# EAGLE design YOTSUBA_MC_ver.2.0 (EAGLE 9.6.2)
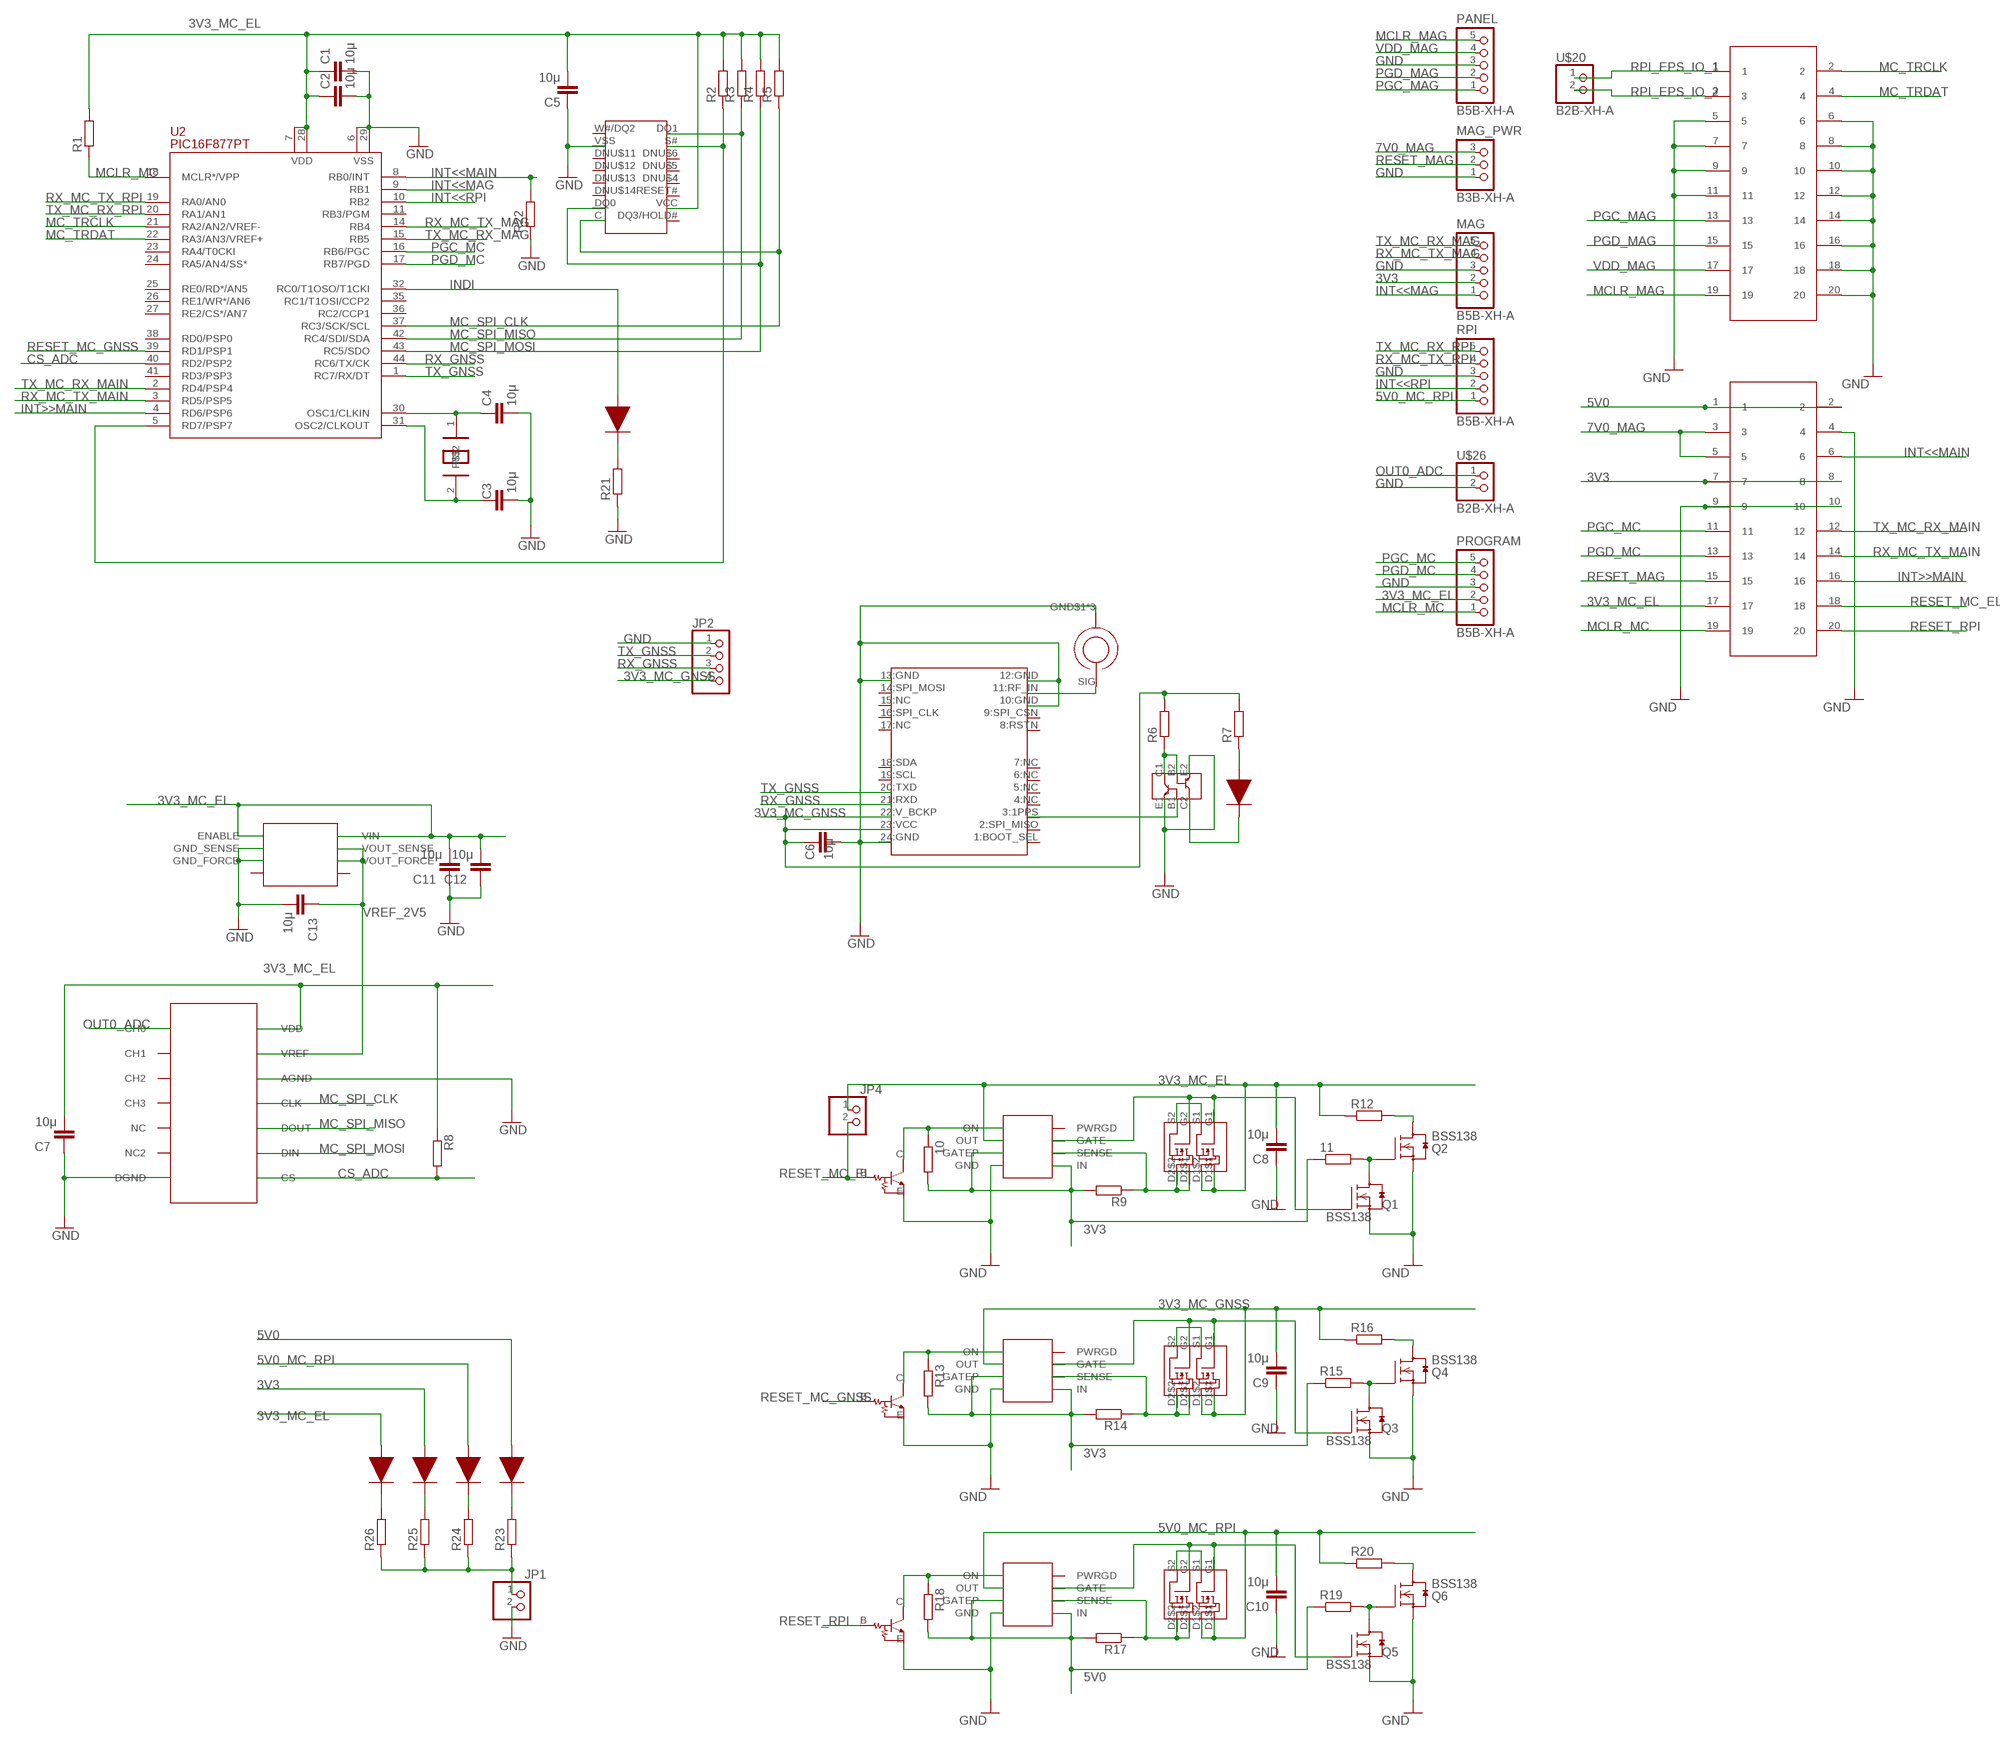
[diagram p0: schematic, sheet 1]

## Parts
10  R-EU_M2012  [M2012]
11  R-EU_M2012  [M2012]
C1  10μ  C-EUC2012  [C2012]
C2  10μ  C-EUC2012  [C2012]
C3  10μ  C-EUC2012  [C2012]
C4  10μ  C-EUC2012  [C2012]
C5  10μ  C-EUC2012  [C2012]
C6  10μ  C-EUC2012  [C2012]
C7  10μ  C-EUC2012  [C2012]
C8  10μ  C-EUC2012  [C2012]
C9  10μ  C-EUC2012  [C2012]
C10  10μ  C-EUC2012  [C2012]
C11  10μ  C-EUC2012  [C2012]
C12  10μ  C-EUC2012  [C2012]
C13  10μ  C-EUC2012  [C2012]
CLK1  HC49/4H  [HC49/4H]
JP1  PINHD-1X2  [1X02]
JP2  PINHD-1X4  [1X04]
JP4  PINHD-1X2  [1X02]
MAG  B5B-XH-A  [B5B-XH-A]
MAG_PWR  B3B-XH-A  [B3B-XH-A]
PANEL  B5B-XH-A  [B5B-XH-A]
PROGRAM  B5B-XH-A  [B5B-XH-A]
Q1  BSS138  [SOT23]
Q2  BSS138  [SOT23]
Q3  BSS138  [SOT23]
Q4  BSS138  [SOT23]
Q5  BSS138  [SOT23]
Q6  BSS138  [SOT23]
R1  R-EU_M2012  [M2012]
R2  R-EU_M2012  [M2012]
R3  R-EU_M2012  [M2012]
R4  R-EU_M2012  [M2012]
R5  R-EU_M2012  [M2012]
R6  R-EU_M2012  [M2012]
R7  R-EU_M2012  [M2012]
R8  R-EU_M2012  [M2012]
R9  R-EU_M2012  [M2012]
R12  R-EU_M2012  [M2012]
R13  R-EU_M2012  [M2012]
R14  R-EU_M2012  [M2012]
R15  R-EU_M2012  [M2012]
R16  R-EU_M2012  [M2012]
R17  R-EU_M2012  [M2012]
R18  R-EU_M2012  [M2012]
R19  R-EU_M2012  [M2012]
R20  R-EU_M2012  [M2012]
R21  R-EU_M2012  [M2012]
R22  R-EU_M2012  [M2012]
R23  R-EU_M2012  [M2012]
R24  R-EU_M2012  [M2012]
R25  R-EU_M2012  [M2012]
R26  R-EU_M2012  [M2012]
RPI  B5B-XH-A  [B5B-XH-A]
U2  PIC16F877PT  [TQFP44]
U$1  MT25QL512_16SOP2  [SOIC127P1032X265-16N]
U$2  ORION_B16  [ORION_B16]
U$3  HN1C01FU  [SOT65P210X100-6N]
U$4  LED_1608  [LED_1608]
U$5  U.FL-R  [U.FL-R]
U$6  MCP3204_S  [MCP3204_S]
U$7  DMG6898LSD  [SOIC127P600X150-8N]
U$8  LTC4361  [SOP65P280X100-8N]
U$9  DTC144EKA  [SOT-346]
U$10  DMG6898LSD  [SOIC127P600X150-8N]
U$11  LTC4361  [SOP65P280X100-8N]
U$12  DTC144EKA  [SOT-346]
U$13  DMG6898LSD  [SOIC127P600X150-8N]
U$14  LTC4361  [SOP65P280X100-8N]
U$15  DTC144EKA  [SOT-346]
U$17  M50-3001045  [M50-3001045]
U$18  LED_1608  [LED_1608]
U$19  ADR35XX  [SOP65P490X110-8N]
U$20  B2B-XH-A  [B2B-XH-A]
U$21  LED_1608  [LED_1608]
U$22  M50-3001045  [M50-3001045]
U$23  LED_1608  [LED_1608]
U$24  LED_1608  [LED_1608]
U$25  LED_1608  [LED_1608]
U$26  B2B-XH-A  [B2B-XH-A]

## Nets
3V3 [POWER]: 10.2 11.1 MAG.2 R9.2 R13.2 R14.2 R15.1 U$8.GATEP U$8.IN U$11.GATEP U$11.IN U$17.7 U$17.8 U$24.A
3V3_MC_EL [POWER]: C1.1 C2.1 C5.2 C7.2 C8.2 C11.2 C12.2 JP4.1 PROGRAM.2 R1.2 R2.2 R3.2 R4.2 R5.2 R8.1 R12.1 U2.7(VDD) U2.28(VDD) U$1.VCC U$6.VDD U$7.D1$1 U$7.D1$2 U$8.OUT U$17.17 U$19.ENABLE U$19.VIN U$25.A
3V3_MC_GNSS [POWER]: C6.1 C9.2 JP2.4 R6.2 R7.2 R16.1 U$2.22:V_BCKP U$2.23:VCC U$10.D1$1 U$10.D1$2 U$11.OUT
5V0 [POWER]: R17.2 R18.2 R19.1 U$14.GATEP U$14.IN U$17.1 U$17.2 U$21.A
5V0_MC_RPI [POWER]: C10.2 R20.1 RPI.1 U$13.D1$1 U$13.D1$2 U$14.OUT U$23.A
7V0_MAG [POWER]: MAG_PWR.3 U$17.3 U$17.5
CS_ADC: R8.2 U2.40(RD2/PSP2) U$6.CS
GND [gnd]: C1.2 C2.2 C3.2 C4.2 C5.1 C6.2 C7.1 C8.1 C9.1 C10.1 C11.1 C12.1 C13.2 JP1.2 JP2.1 MAG.3 MAG_PWR.1 PANEL.3 PROGRAM.3 Q1.2(S) Q2.2(S) Q3.2(S) Q4.2(S) Q5.2(S) Q6.2(S) R21.1 R22.1 RPI.3 U2.6(VSS) U2.29(VSS) U$1.VSS U$2.10:GND U$2.12:GND U$2.13:GND U$2.24:GND U$3.E1 U$3.E2 U$5.GND$1(GND) U$5.GND$2(GND) U$5.GND$3(GND) U$6.AGND U$6.DGND U$8.GND U$9.E U$11.GND U$12.E U$14.GND U$15.E U$17.4 U$17.9 U$17.10 U$19.GND_FORCE U$19.GND_SENSE U$22.5 U$22.6 U$22.7 U$22.8 U$22.9 U$22.10 U$22.11 U$22.12 U$22.14 U$22.16 U$22.18 U$22.20 U$26.2
INDI: U2.32(RC0/T1OSO/T1CKI) U$18.A
INT<<MAG: MAG.1 U2.9(RB1)
INT<<MAIN: R22.2 U2.8(RB0/INT) U$17.6
INT<<RPI: RPI.2 U2.10(RB2)
INT>>MAIN: U2.4(RD6/PSP6) U$17.16
MC_SPI_CLK: R5.1 U2.37(RC3/SCK/SCL) U$1.C U$6.CLK
MC_SPI_MISO: R3.1 U2.42(RC4/SDI/SDA) U$1.DQ1 U$6.DOUT
MC_SPI_MOSI: R4.1 U2.43(RC5/SDO) U$1.DQ0 U$6.DIN
MC_TRCLK: U2.21(RA2/AN2/VREF-) U$22.2
MC_TRDAT: U2.22(RA3/AN3/VREF+) U$22.4
MCLR_MAG: PANEL.5 U$22.19
MCLR_MC: PROGRAM.1 R1.1 U2.18(MCLR*/VPP) U$17.19
N$2: R23.2 U$21.C
N$3: C3.1 CLK1.2 U2.31(OSC2/CLKOUT)
N$4: R24.2 U$23.C
N$5: C4.1 CLK1.1 U2.30(OSC1/CLKIN)
N$6: R25.2 U$24.C
N$7: R26.2 U$25.C
N$8: R2.1 U2.5(RD7/PSP7) U$1.S#
N$9: JP1.1 R23.1 R24.1 R25.1 R26.1
N$10: R7.1 U$4.A
N$11: U$3.C2 U$4.C
N$12: U$2.3:1PPS U$3.B1
N$13: R6.1 U$3.B2 U$3.C1
N$15: R21.2 U$18.C
N$17: 10.1 U$8.ON U$9.C
N$18 [ant]: U$2.11:RF_IN U$5.SIG
N$19: U$7.S1 U$7.S2
N$20: R9.1 U$7.D2$1 U$7.D2$2 U$8.SENSE
N$22: Q1.1(G) U$7.G1 U$7.G2 U$8.GATE
N$24: 11.2 Q1.3(D) Q2.1(G)
N$25: R13.1 U$11.ON U$12.C
N$26: Q2.3(D) R12.2
N$28: U$10.S1 U$10.S2
N$29: R14.1 U$10.D2$1 U$10.D2$2 U$11.SENSE
N$30: Q3.1(G) U$10.G1 U$10.G2 U$11.GATE
N$33: Q3.3(D) Q4.1(G) R15.2
N$34: Q4.3(D) R16.2
N$35: R18.1 U$14.ON U$15.C
N$36: U$13.S1 U$13.S2
N$37: R17.1 U$13.D2$1 U$13.D2$2 U$14.SENSE
N$38: Q5.1(G) U$13.G1 U$13.G2 U$14.GATE
N$41: Q5.3(D) Q6.1(G) R19.2
N$42: Q6.3(D) R20.2
OUT0_ADC: U$6.CH0 U$26.1
PGC_MAG: PANEL.1 U$22.13
PGC_MC: PROGRAM.5 U2.16(RB6/PGC) U$17.11
PGD_MAG: PANEL.2 U$22.15
PGD_MC: PROGRAM.4 U2.17(RB7/PGD) U$17.13
RESET_MAG: MAG_PWR.2 U$17.15
RESET_MC_EL: JP4.2 U$9.B U$17.18
RESET_MC_GNSS: U2.39(RD1/PSP1) U$12.B
RESET_RPI: U$15.B U$17.20
RPI_EPS_IO_1: U$20.1 U$22.1
RPI_EPS_IO_2: U$20.2 U$22.3
RX_GNSS: JP2.3 U2.44(RC6/TX/CK) U$2.21:RXD
RX_MC_TX_MAG: MAG.4 U2.14(RB4)
RX_MC_TX_MAIN: U2.3(RD5/PSP5) U$17.14
RX_MC_TX_RPI: RPI.4 U2.19(RA0/AN0)
TX_GNSS: JP2.2 U2.1(RC7/RX/DT) U$2.20:TXD
TX_MC_RX_MAG: MAG.5 U2.15(RB5)
TX_MC_RX_MAIN: U2.2(RD4/PSP4) U$17.12
TX_MC_RX_RPI: RPI.5 U2.20(RA1/AN1)
VDD_MAG: PANEL.4 U$22.17
VREF_2V5: C13.1 U$6.VREF U$19.VOUT_FORCE U$19.VOUT_SENSE
Unconnected: U2.11(RB3/PGM) U2.23(RA4/T0CKI) U2.24(RA5/AN4/SS*) U2.25(RE0/RD*/AN5) U2.26(RE1/WR*/AN6) U2.27(RE2/CS*/AN7) U2.35(RC1/T1OSI/CCP2) U2.36(RC2/CCP1) U2.38(RD0/PSP0) U2.41(RD3/PSP3) U$1.DNU$4 U$1.DNU$5 U$1.DNU$6 U$1.DNU$11 U$1.DNU$12 U$1.DNU$13 U$1.DNU$14 U$1.DQ3/HOLD# U$1.RESET# U$1.W#/DQ2 U$2.1:BOOT_SEL U$2.2:SPI_MISO U$2.4:NC U$2.5:NC U$2.6:NC U$2.7:NC U$2.8:RSTN U$2.9:SPI_CSN U$2.14:SPI_MOSI U$2.15:NC U$2.16:SPI_CLK U$2.17:NC U$2.18:SDA U$2.19:SCL U$6.CH1 U$6.CH2 U$6.CH3 U$6.NC1(NC) U$6.NC2 U$8.PWRGD U$11.PWRGD U$14.PWRGD U$19.NIC@1(NIC) U$19.NIC@2(NIC)

## Library data of the parts
10 11 R1-R9 R12-R26 = rcl:R-EU_: RESISTOR, European symbol; SPICEPREFIX: R
C1-C13 = rcl:C-EU: CAPACITOR, European symbol; SPICEPREFIX: C
CLK1 = aoba01:HC49/4H
JP1 JP4 = pinhead:PINHD-1X2: PIN HEADER
JP2 = pinhead:PINHD-1X4: PIN HEADER
MAG PANEL PROGRAM RPI = MITSUBA_Connectors-v4.0:B5B-XH-A
MAG_PWR = MITSUBA_Connectors-v4.0:B3B-XH-A
Q1-Q6 = m-pad-2.1:BSS138: Fairchild Semiconductors BSS138 N-Channel Logic Level Enhancement Mode Field Effect Transistor General Description: These N-Channel enhancement mode field effect transistors are produced using Fairchild's proprietary, high cell density, DMOS technology. These products have been designed to minimize on-state resistance while provide rugged, reliable, and fast switching performance.These products are particularly suited for low voltage, low current applications such as small servo motor control, power MOSFET gate drivers, and other switching applications. Features: 0.22 A, 50 V. RDS(ON) = 3.5Ohm @ VGS = 10 V RDS(ON) = 6.0Ohm @ VGS = 4.5 V High density cell design for extremely low RDS(ON) Rugged and Reliable Compact industry standard SOT-23 surface mount package Please send any comments to: messi@users.sourceforge.net
U2 = aoba01:PIC16F877: FLASH MICROCONTROLLER
U$1 = MT25QL512_8:MT25QL512_16SOP2
U$2 = Orion_B16:ORION_B16
U$3 = HN1C01FU:HN1C01FU
U$4 U$18 U$21 U$23-U$25 = LED_1608:LED_1608
U$5 = U.FL-R:U.FL-R
U$6 = mcp3204_S:MCP3204_S
U$7 U$10 U$13 = DMG6898LSD:DMG6898LSD
U$8 U$11 U$14 = ltc4361:LTC4361
U$9 U$12 U$15 = DTC144EKA:DTC144EKA
U$17 U$22 = MITSUBA_Connectors-v4.0:M50-3001045: 20pins 1.27mm pitch 2line pinsocket
U$19 = adr35xx:ADR35XX
U$20 U$26 = MITSUBA_Connectors-v4.0:B2B-XH-A

## Net classes
0 default: clearance 0.178 mm
1 ant: clearance 0.559 mm
2 gnd: clearance 0.508 mm
3 POWER: width 0.305 mm, clearance 0.254 mm

## Board
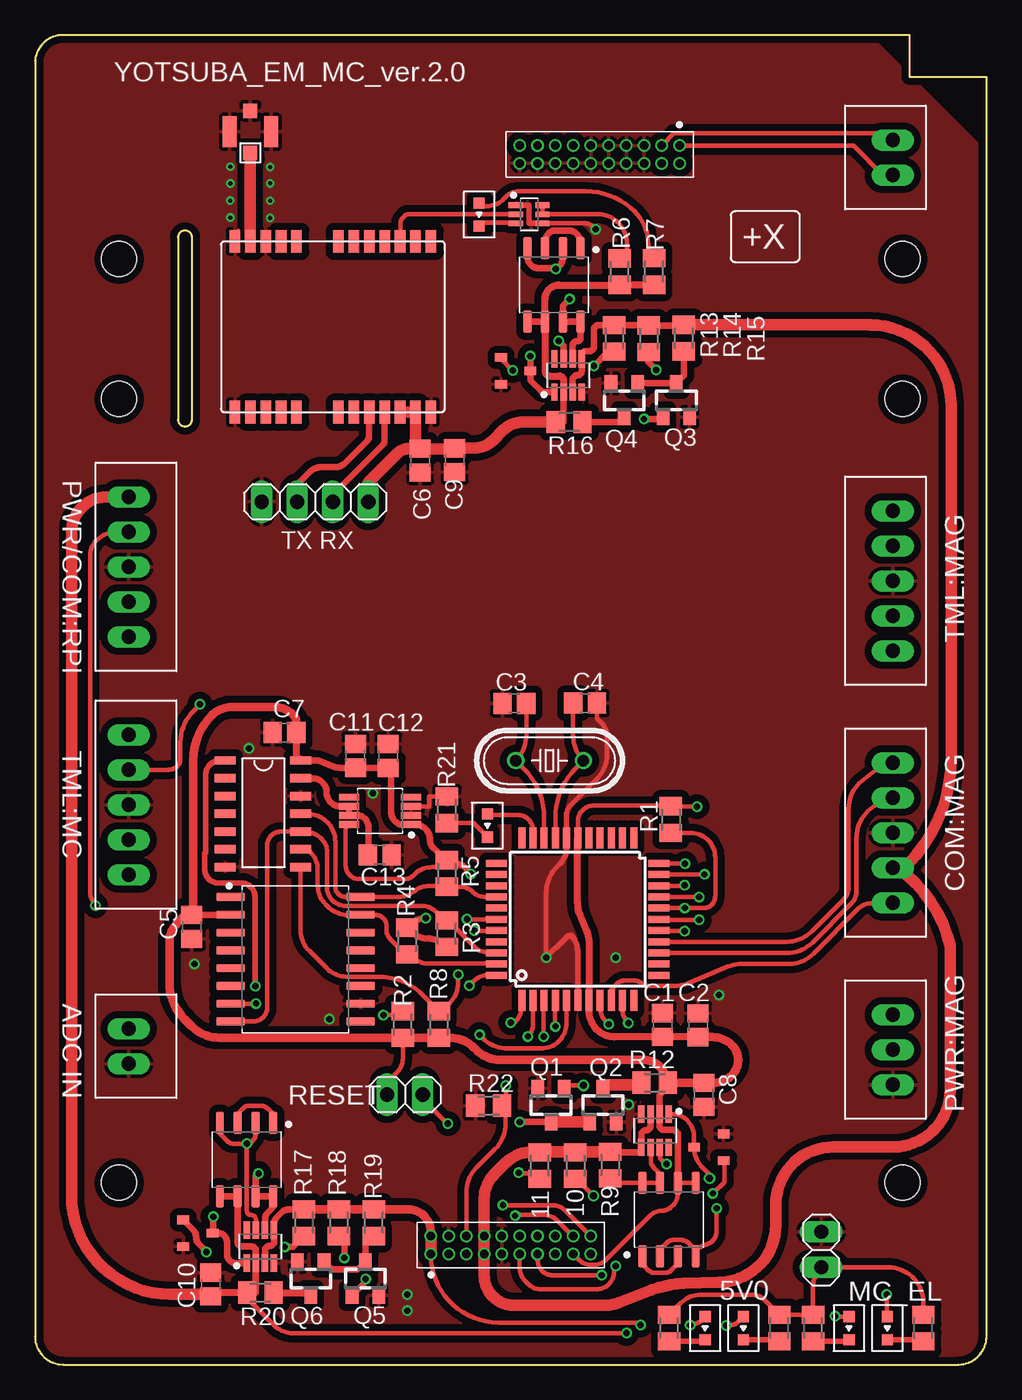
[diagram p1: board, top side]
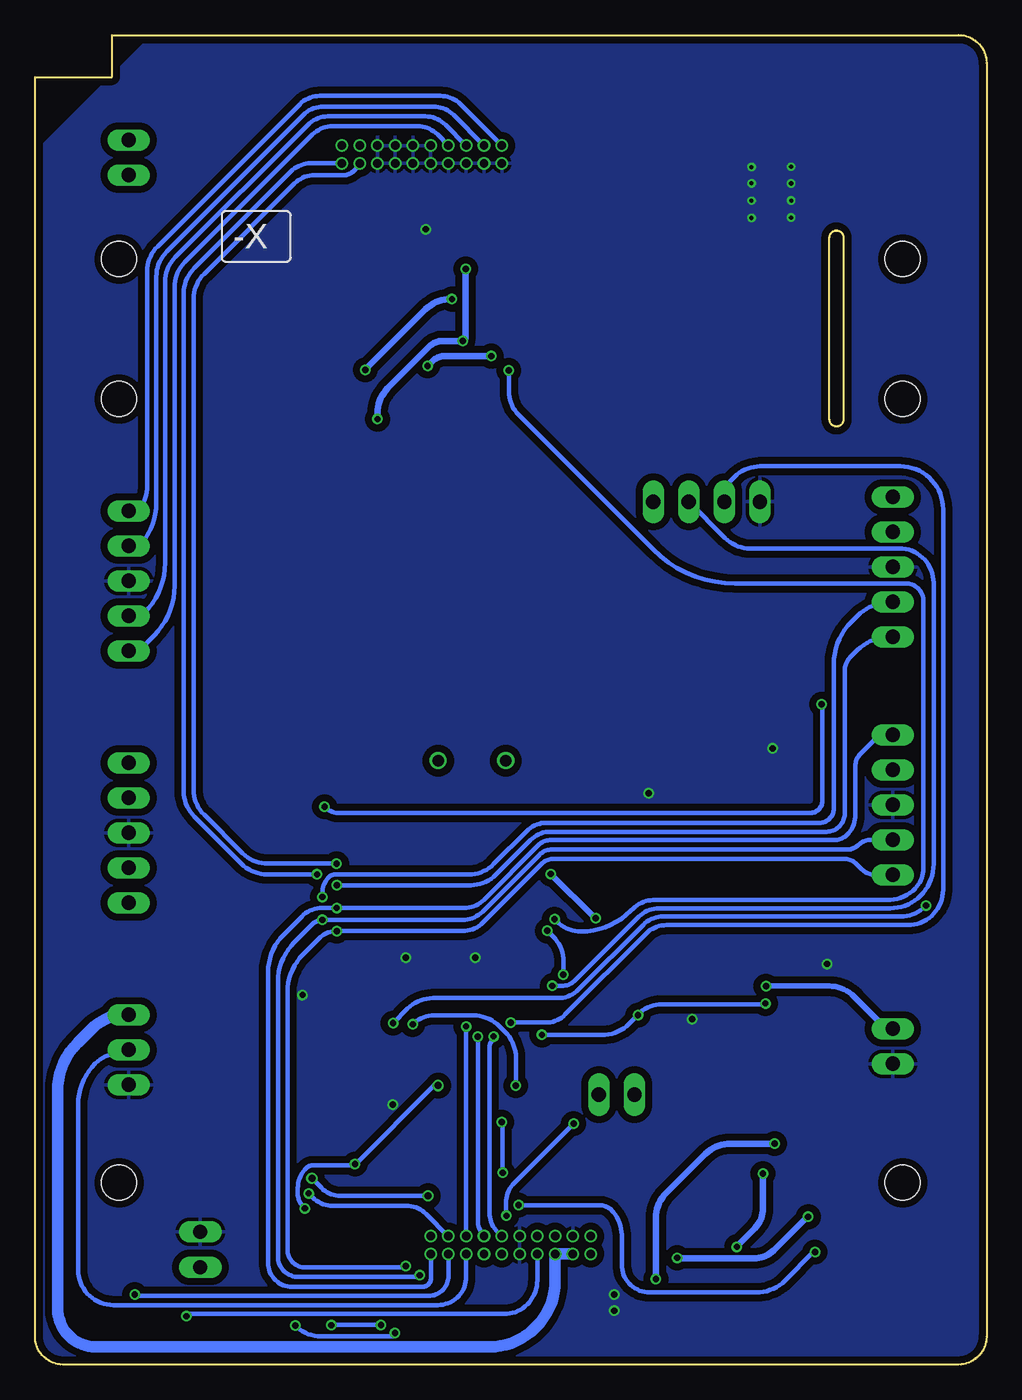
[diagram p2: board, bottom side, seen from below]

Size 68 x 95 mm. Coordinates in mm from the lower left corner, seen from the top.
Outline: 0,93 0,2 arc90 2,0 66,0 arc90 68,2 68,92 62.5,92 62.5,95 2,95 arc90 0,93
Outline: 11.22,67.53 11.22,80.53 arc90 10.72,81.03 arc90 10.22,80.53 10.22,67.53 arc90 10.72,67.03 arc90 11.22,67.53
Copper layers (1*16): Top 0.035mm / dielectric 1.53mm / Bottom 0.035mm
Design rules "pban_5mil-l2": minimum track width 5mil, minimum drill 0.3mm, track to track 5mil, track to pad 0.229mm, pad to pad 5mil, via to via 5mil, smd to smd 5mil, copper to edge 0.5mm, drill to drill 0.5mm, minimum pad ring 0.15mm, minimum via ring 0.15mm, stop-mask expansion 4mil, vias tented up to drill 0.35mm, thermal gap 10mil
Holes 2.5 mm at 6,13 62,13 62,69 62,79 6,79 6,69

### Footprints (pad centres in the part's own frame; a part is rotated, then mirrored left to right if it is on the bottom)
M2012 = smd 1.3 x 1.6: 1 -0.95,0; 2 0.95,0
C2012 = smd 1.3 x 1.5: 1 -0.85,0; 2 0.85,0
HC49/4H = drill 0.813: 1 -2.413,0; 2 2.413,0
1X02 = drill 1.016 long: 1 -1.27,0; 2 1.27,0
1X04 = drill 1.016 long: 1 -3.81,0; 2 -1.27,0; 3 1.27,0; 4 3.81,0
B5B-XH-A = drill 1.016 long: 1 0,0; 2 2.5,0; 3 5,0; 4 7.5,0; 5 10,0
B3B-XH-A = drill 1.016 long: 1 0,0; 2 2.5,0; 3 5,0
SOT23 = smd 0.9 x 1.2: 1 -0.95,-1.2; 2 0.95,-1.2; 3 0,1.2
TQFP44 = smd 1.5 x 0.5: 1 -5.8,4; 2 -5.8,3.2; 3 -5.8,2.4; 4 -5.8,1.6; 5 -5.8,0.8; 6 -5.8,0; 7 -5.8,-0.8; 8 -5.8,-1.6; 9 -5.8,-2.4; 10 -5.8,-3.2; 11 -5.8,-4; 23 5.8,-4; 24 5.8,-3.2; 25 5.8,-2.4; 26 5.8,-1.6; 27 5.8,-0.8; 28 5.8,0; 29 5.8,0.8; 30 5.8,1.6; 31 5.8,2.4; 32 5.8,3.2; 33 5.8,4 | smd 0.5 x 1.5: 12 -4,-5.8; 13 -3.2,-5.8; 14 -2.4,-5.8; 15 -1.6,-5.8; 16 -0.8,-5.8; 17 0,-5.8; 18 0.8,-5.8; 19 1.6,-5.8; 20 2.4,-5.8; 21 3.2,-5.8; 22 4,-5.8; 34 4,5.8; 35 3.2,5.8; 36 2.4,5.8; 37 1.6,5.8; 38 0.8,5.8; 39 0,5.8; 40 -0.8,5.8; 41 -1.6,5.8; 42 -2.4,5.8; 43 -3.2,5.8; 44 -4,5.8
SOIC127P1032X265-16N = smd 2.052 x 0.602: C 4.654,4.445; DNU$4 -4.654,0.635; DNU$5 -4.654,-0.635; DNU$6 -4.654,-1.905; DNU$11 4.654,-1.905; DNU$12 4.654,-0.635; DNU$13 4.654,0.635; DNU$14 4.654,1.905; DQ0 4.654,3.175; DQ1 -4.654,-4.445; DQ3/HOLD# -4.654,4.445; RESET# -4.654,1.905; S# -4.654,-3.175; VCC -4.654,3.175; VSS 4.654,-3.175; W#/DQ2 4.654,-4.445
ORION_B16 = smd 1.6 x 0.8: 1:BOOT_SEL 12.2,1; 2:SPI_MISO 12.2,2.1; 3:1PPS 12.2,3.2; 4:NC 12.2,4.3; 5:NC 12.2,5.4; 6:NC 12.2,6.5; 7:NC 12.2,7.6; 8:RSTN 12.2,10.6; 9:SPI_CSN 12.2,11.7; 10:GND 12.2,12.8; 11:RF_IN 12.2,13.9; 12:GND 12.2,15; 13:GND 0,15; 14:SPI_MOSI 0,13.9; 15:NC 0,12.8; 16:SPI_CLK 0,11.7; 17:NC 0,10.6; 18:SDA 0,7.6; 19:SCL 0,6.5; 20:TXD 0,5.4; 21:RXD 0,4.3; 22:V_BCKP 0,3.2; 23:VCC 0,2.1; 24:GND 0,1
SOT65P210X100-6N = smd 1.005 x 0.397: B1 -0.962,0; B2 0.962,0; C1 0.962,0.65; C2 -0.962,-0.65; E1 -0.962,0.65; E2 0.962,-0.65
LED_1608 = smd 0.8 x 0.8: A 0.4,0.4; C 2.05,0.4
U.FL-R = smd 1.05 x 2.2: GND$1 -1.475,0; GND$2 1.475,0 | smd 1.05 x 1: GND$3 0,1.5; SIG 0,-1.5
MCP3204_S = smd 0.6 x 1.5: AGND 2.54,0; CH0 0,-5.4; CH1 1.27,-5.4; CH2 2.54,-5.4; CH3 3.81,-5.4; CLK 3.81,0; CS 7.62,0; DGND 7.62,-5.4; DIN 6.35,0; DOUT 5.08,0; NC1 5.08,-5.4; NC2 6.35,-5.4; VDD 0,0; VREF 1.27,0
SOIC127P600X150-8N = smd 1.58 x 0.589: D1$1 -2.625,1.905; D1$2 -2.625,0.635; D2$1 -2.625,-0.635; D2$2 -2.625,-1.905; G1 2.625,1.905; G2 2.625,-0.635; S1 2.625,0.635; S2 2.625,-1.905
SOP65P280X100-8N = smd 1.237 x 0.459: GATE 1.187,0.325; GATEP -1.187,-0.325; GND -1.187,-0.975; IN 1.187,-0.975; ON -1.187,0.975; OUT -1.187,0.325; PWRGD 1.187,0.975; SENSE 1.187,-0.325
SOT-346 = smd 0.6 x 0.9: B 0,0; C 0.95,2.1; E 1.9,0
M50-3001045 = drill 0.6: 1 0,0; 2 0,1.27; 3 1.27,0; 4 1.27,1.27; 5 2.54,0; 6 2.54,1.27; 7 3.81,0; 8 3.81,1.27; 9 5.08,0; 10 5.08,1.27; 11 6.35,0; 12 6.35,1.27; 13 7.62,0; 14 7.62,1.27; 15 8.89,0; 16 8.89,1.27; 17 10.16,0; 18 10.16,1.27; 19 11.43,0; 20 11.43,1.27
SOP65P490X110-8N = smd 1.424 x 0.497: ENABLE -2.219,0.975; GND_FORCE -2.219,-0.325; GND_SENSE -2.219,0.325; NIC@1 -2.219,-0.975; NIC@2 2.219,-0.975; VIN 2.219,0.975; VOUT_FORCE 2.219,-0.325; VOUT_SENSE 2.219,0.325
B2B-XH-A = drill 1.016 long: 1 0,0; 2 2.5,0

### Placement (x,y rotation side)
10  38.62,14.22 90 top
11  36.07,14.21 270 top
C1  44.85,24.26 90 top
C2  47.39,24.25 90 top
C3  34.26,47.24 180 top
C4  39.31,47.26 0 top
C5  11.2,31.27 90 top
C6  27.53,64.59 270 top
C7  17.83,45.16 0 top
C8  47.8,19.27 90 top
C9  29.99,64.62 90 top
C10  12.57,5.72 270 top
C11  22.9,43.49 270 top
C12  25.24,43.48 270 top
C13  24.63,36.42 0 top
CLK1  36.77,43.15 180 top
JP1  56.19,8.21 90 top
JP2  20.01,61.65 0 top
JP4  26.44,19.28 0 top
MAG  61.3,33 90 top
MAG_PWR  61.3,20 90 top
PANEL  61.3,51 90 top
PROGRAM  6.7,45 270 top
Q1  36.88,18.54 180 top
Q2  40.59,18.55 0 top
Q3  45.83,68.91 0 top
Q4  42.11,68.91 180 top
Q5  23.61,6.13 0 top
Q6  19.71,6.13 180 top
R1  45.44,38.94 90 top
R2  26.29,24.3 270 top
R3  29.42,30.78 270 top
R4  26.59,30.26 90 top
R5  29.43,35.09 90 top
R6  41.79,78.09 270 top
R7  44.24,78.1 270 top
R8  28.86,24.3 90 top
R9  41.1,14.25 90 top
R12  44.29,20.15 180 top
R13  41.39,73.32 90 top
R14  43.85,73.3 90 top
R15  46.37,73.34 270 top
R16  38.17,67.34 0 top
R17  19.21,10.13 90 top
R18  21.71,10.13 90 top
R19  24.21,10.13 270 top
R20  16.11,5.13 0 top
R21  29.44,39.63 270 top
R22  32.42,18.49 0 top
R23  45.32,2.6 270 top
R24  53.2,2.6 270 top
R25  55.6,2.6 270 top
R26  63.48,2.6 270 top
RPI  6.7,62 270 top
U2  38.79,31.81 90 top
U$1  18.62,28.96 0 top
U$2  29.29,68.05 90 top
U$3  35.32,82.19 0 top
U$4  31.34,83.39 270 top
U$5  15.39,88.08 0 top
U$6  18.99,43.16 270 top
U$7  45.31,10.35 270 top
U$8  44.31,16.7 270 top
U$9  49.21,14.58 90 top
U$10  37.09,77.15 90 top
U$11  38.1,70.67 90 top
U$12  33.3,71.95 270 top
U$13  15.12,14.64 90 top
U$14  16.11,8.43 90 top
U$15  10.59,10.34 270 top
U$17  28.29,7.9 0 top
U$18  31.93,39.73 270 top
U$19  24.66,39.56 180 top
U$20  61.3,85 90 top
U$21  47.49,3.83 270 top
U$22  46.07,87.1 180 top
U$23  50.23,3.83 270 top
U$24  57.77,3.83 270 top
U$25  60.51,3.83 270 top
U$26  6.7,24 270 top

### Tracks (layer width: path | path; a pad name or v marks a point on that pad's centre or on a via)
3V3  (via drill 0.45)
  Top 0.305: 41.07,15.17 R9.2 41.26,15.2 | U$8.IN 43.34,15.44 43.09,15.2 | v57.17,3.45 57.19,3.43 U$24.A
  Top 0.45: U$8.GATEP 43.98,17.05 arc-90 43.67,16.73 43.65,16.73 arc90 43.33,16.41 43.33,15.44 43.34,15.44 | U$8.IN 43.34,15.17 41.07,15.17 | U$11.GATEP 38.42,70.36 arc-90 38.74,70.68 38.76,70.68 arc90 39.08,71 U$11.IN 39.08,72.1 arc-90 39.39,72.42 39.63,72.42 arc90 39.95,72.73 39.95,73.95 arc-90 40.26,74.27 R13.2 43.85,74.27 R14.2 46.37,74.25 R15.1
  Top 0.813: 10.2 38.65,15.2 | 38.65,15.2 41.26,15.2 | 38.65,15.2 36.11,15.2 11.1 35.42,15.16 arc45 33.63,14.42 32.83,13.62 arc45 32.1,11.85 U$17.8 U$17.7 32.1,6.36 arc90 34.23,4.23 40.78,4.23 arc21 41.7,4.4 44.09,5.33 arc-19 46.34,5.79 48.84,5.87 arc90 52.94,9.97 52.94,11.43 arc-90 57.06,15.55 61.34,15.55 arc90 65.41,19.62 65.41,29.91 arc41 61.64,35.5 MAG.2 62.29,35.5 62.29,35.67 arc45 65.48,43.37 65.48,68.46 arc90 59.66,74.28 59.66,74.29 R15.1
  Bottom 0.305: U$17.7 32.1,6.03 arc45 32.82,4.29 arc45 34.46,3.61 57.17,3.61 v57.17,3.45
3V3_MC_EL  (via drill 0.45)
  Top 0.305: 45.51,20.42 R12.1 45.24,20.05 45.24,19.84 | U$8.OUT 44.62,17.9 | U$7.D1$1 U$7.D1$2 45.95,12.26 arc-45 45.57,11.36 45.46,11.25 arc-45 44.84,10.99 arc45 43.94,10.62 40.8,7.48 arc-45 39.9,7.11 39.77,7.11 arc-45 38.87,7.48 U$17.17 | 26.87,31.21 R4.2 26.87,31.49 27.13,31.49 | R3.2 29.34,29.91 29.2,29.91 | 13.86,32.13 U$1.VCC | 27.15,38.59 U$19.ENABLE | U2.28 38.79,38.8 arc-90 39.93,39.94 45.39,39.94 arc-90 R1.2 47.31,39.89 v47.31,39.85 | 28.82,36.54 29.21,36.15 29.32,36.15 R5.2 29.22,36.04 28.72,35.54 28.39,35.54 arc45 27.11,35.01 27.07,34.97 arc-45 26.37,34.68 23.2,34.68 arc-90 22.2,35.68 22.2,38.34 U$19.VIN 22.86,38.59 | v60.87,4.99 60.87,3.43 U$25.A | R2.2 26.29,21.83 arc-45 25.92,20.93 25.17,20.18 JP4.1 | PROGRAM.2 9.51,42.5 arc45 10.21,42.79 arc45 10.39,43.23 10.39,44.44 arc-45 11.32,46.69 11.79,47.16 v11.79,47.18
  Top 0.45: U$7.D1$2 45.94,12.98 45.94,16.44 arc90 45.62,16.76 44.95,16.76 arc-90 44.63,17.08 U$8.OUT 44.63,19.23 45.24,19.84 | U$6.VDD 20.04,43.16 arc-22 20.53,43.06 21.32,42.74 arc22 21.8,42.64 C11.2 C12.2 arc-90 25.46,42.41 25.46,39.49 arc90 26.41,38.54 arc-90 26.45,38.59 U$19.ENABLE 27.12,38.59 arc-90 28.23,37.48 arc45 28.47,36.9 28.82,36.55 28.82,36.54 | R5.2 arc-45 29.55,36.04 30.66,35.58 31.1,35.14 31.1,35.1 v31.15,35.05 | 29.34,29.91 arc45 28.04,30.45 27.96,30.45 arc-45 26.92,30.88 R4.2 26.82,31.44 arc-45 v27.93,31.9 | C5.2 13.86,32.13
  Top 0.508: U2.28 38.78,33.02 arc23 38.97,32.06 39.41,31 arc-23 39.6,30.05 U2.7 39.59,25.33 arc45 40.18,23.91 arc45 41.39,23.41 C1.1 C2.1 | R4.2 26.64,31.16 | U$6.VDD 18.68,43.47 C7.2
  Top 0.61: 47.43,23.36 C2.1 48.4,23.4 arc-45 49.82,22.81 arc-45 50.25,21.77 arc-45 49.79,20.65 arc-45 48.52,20.12 C8.2 45.31,20.12 45.24,20.05 | R12.1 45.13,20.15 arc90 43.51,21.77 33.28,21.77 arc-45 31.51,22.5 31.39,22.62 arc45 29.62,23.35 R8.1 R2.2 13.18,23.35 arc-45 11.2,24.17 10.66,24.71 arc-45 9.62,27.24 9.62,30.24 arc-45 10.15,31.52 10.74,32.12 C5.2 11.32,32.24 11.32,43.19 arc-45 12.64,46.38 arc-45 14.09,46.98 17.12,46.98 arc-45 18.46,46.43 arc-45 18.68,45.89 C7.2 | 44.95,39.89 R1.2
  Top 0.813: C2.1 47.81,23.4 47.84,23.37 | R1.2
  Bottom 0.305: U$17.17 38.45,6.32 arc90 39.86,4.91 60.79,4.91 v60.87,4.99 | v47.31,39.85 arc-45 46.22,39.4 12.65,39.4 arc-90 11.72,40.33 11.72,47.11 v11.79,47.18
  Bottom 0.45: v27.93,31.9 28,31.9 v31.15,35.05
3V3_MC_GNSS
  Top 0.45: U$11.OUT 37.77,67.34 R16.1 | 29.99,65.45 C9.2 | U$10.D1$1 U$10.D1$2
  Top 0.508: U$11.OUT 37.77,70.32 arc90 37.46,70.64 36.77,70.64 arc-90 36.45,70.96 U$10.D1$2 36.45,76.14 arc-90 37.45,77.14 R6.2 R7.2
  Top 0.61: U$10.D1$2 36.45,73.83
  Top 0.813: C6.1 arc-90 27.19,65.78 U$2.23:VCC U$2.22:V_BCKP | C6.1 27.55,65.42 29.94,65.42 C9.2 31.35,65.47 arc45 32.77,66.06 33.46,66.75 arc-45 34.88,67.34 R16.1 | JP2.4 23.82,63.01 25.96,65.15 arc-45 26.66,65.44 C6.1
5V0  (via drill 0.45)
  Top 0.305: U$17.1 28.29,7.83 arc90 33.12,3 43.1,3 v43.27,2.83 | v46.83,2.81 46.91,2.89 46.91,2.92 47.12,2.92 arc45 47.57,3.1 U$21.A
  Top 0.45: U$14.IN 17.09,8.79 arc-90 16.77,8.47 16.75,8.47 arc90 16.43,8.15 U$14.GATEP | U$14.IN 17.09,9.18 | U$14.IN 17.09,10.05 arc-45 17.27,10.5 17.66,10.89 arc-45 18.11,11.08 R17.2
  Top 0.61: R17.2 R18.2 R19.1 26.67,11.08 arc-90 28.29,9.46 28.29,9.13
  Top 0.813: U$17.2 28.29,9.13 | U$17.1 28.29,9.13 | 28.29,9.13 28.24,9.18
  Bottom 0.305: v43.27,2.83 46.83,2.83 v46.83,2.81
5V0_MC_RPI  (via drill 0.45)
  Top 0.305: R20.1 arc45 15.45,4.43 17.05,2.83 arc45 18.47,2.24 v42.27,2.24 | U$23.A 50.21,3.01 arc-45 49.76,2.82 49.44,2.82 v49.4,2.78
  Top 0.45: 15.14,5.13 15.79,5.13 U$14.OUT 15.79,8.11 arc90 15.47,8.43 14.8,8.43 arc-90 14.48,8.75 U$13.D1$2 U$13.D1$1
  Top 0.508: R20.1 15.14,5.13 12.83,5.13 C10.2
  Top 0.813: C10.2 12.43,5.01 9.71,5.01 arc-90 2.61,12.11 2.61,59.46 arc-90 5.15,62 RPI.1
  Bottom 0.305: v42.27,2.24 42.27,2.02 47.59,2.02 arc45 v49.4,2.77 v49.4,2.78
7V0_MAG
  Bottom 0.813: U$17.3 U$17.5 30.83,5.93 arc45 32.15,2.74 32.31,2.58 arc45 35.5,1.26 63.65,1.26 arc90 66.39,4 66.39,19.53 arc45 64.96,22.98 63.96,23.98 arc45 61.49,25 MAG_PWR.3
CS_ADC  (via drill 0.45)
  Top 0.305: U$6.CS 18.99,30.99 arc45 19.58,29.58 20.86,28.3 arc45 22.27,27.71 24.55,27.71 arc-45 27.74,26.39 28.86,25.27 R8.2 29.06,25.25 29.65,25.84 arc45 30.24,27.26 v30.24,27.85 | v31.39,30.99 32.97,30.99 U2.40
  Bottom 0.305: v31.39,30.99 30.96,30.56 arc45 30.23,28.79 v30.23,27.86 v30.24,27.85
GND  (via drill 0.3, 0.45)
  Top 0.305: U$2.10:GND 16.31,80.42 | U$2.12:GND 14.52,80.89 14.53,81.03 | U$3.E2 39.3,81.54 arc-45 39.88,81.3 40.06,81.12 v40.08,81.12 | U$19.GND_FORCE 28.15,39.88 28.15,40.6 29.44,40.6 R21.1 | 37.99,39.36 arc-45 38.2,39.87 40.14,41.81 arc45 40.88,43.6 40.88,44.97 arc45 40.55,45.77 40.16,46.16 C4.2 | U2.29 37.99,36.88 | 37.54,35.79 37.27,35.52 arc45 36.53,33.73 v36.53,29.08
  Top 0.406: U$3.E2 35.32,81.54 35.32,82.84 U$3.E1 | U2.29 37.99,39.36 | 37.99,36.88 arc-45 37.54,35.79 | U2.6 38.79,29.54 arc45 38.33,30.65 arc45 37.94,30.49 v36.53,29.08
  other vias: 26.61,4.99 26.61,3.84 16.8,85.56 16.8,84.4 16.8,81.93 16.8,83.16 13.97,85.59 13.96,84.39 13.95,83.17 13.96,81.95 41.5,29.08 15.29,44.02 24.14,40.83 21.03,24.67 11.4,28.62 48.88,26.41 42.42,18.58
  pour Top: -3.57,2.53 -3.57,95.52 -0.6,98.49 56.17,98.49 71.12,83.54 71.12,1.14 66.85,-3.13 2.09,-3.13
  pour Bottom: -2.1,30.03 -2.1,94.28 0.73,97.11 57.48,97.11 69.8,84.79 69.8,1.77 66.11,-1.92 1.98,-1.92 -2.11,2.17 -2.11,29.87
INDI
  Top 0.305: U2.32 35.59,38.18 arc90 34.51,39.26 32.4,39.26 arc-90 U$18.A
INT<<MAG
  Top 0.305: MAG.1 61.25,32.95 59.75,32.95 arc45 58.85,32.58 55.62,29.35 arc-45 53.85,28.62 50.48,28.62 arc23 49.53,28.43 46.65,27.24 arc-23 45.7,27.05 43.71,27.05 arc-45 43.42,27.17 arc45 42.72,27.46 42.24,27.46 arc45 41.54,27.17 41.19,26.82 U2.9
INT<<MAIN  (via drill 0.45)
  Top 0.305: 40.34,25.96 U2.8 40.39,25.46 arc45 40.76,24.56 v41.01,24.31 | v33.65,19.92 33.65,18.77 R22.2 33.63,18.23 33.63,17.2 arc-45 32.89,15.41 31.56,14.08 arc45 30.83,12.31 U$17.6
  Bottom 0.305: v41.01,24.31 arc45 39.49,24.94 36.67,24.94 arc45 34.81,24.17 34.39,23.75 arc45 33.63,21.91 33.63,19.94 v33.65,19.92
INT<<RPI  (via drill 0.45)
  Top 0.305: U2.10 41.99,25.34 arc45 42.36,24.44 v42.41,24.39 | RPI.2 5.87,59.5 arc45 4.41,58.89 arc45 3.93,57.74 3.93,33.82 arc45 4.33,32.85 v4.33,32.8
  Bottom 0.305: v4.33,32.8 4.41,32.72 arc45 6.13,32.01 23.11,32.01 arc-45 24.53,31.42 29.18,26.77 arc45 30.6,26.18 39.57,26.18 arc-45 41.36,25.44 v42.41,24.39
INT>>MAIN  (via drill 0.45)
  Top 0.305: U2.4 37.17,25.99 37.17,24.16 v37.19,24.16
  Bottom 0.305: v37.19,24.16 37.19,22.66 37.19,9.5 37.18,9.49 U$17.16
MC_SPI_CLK
  Top 0.305: 32.98,33.42 U2.37 | U$6.CLK 19.46,39.35 arc-45 20.88,38.76 20.88,38.76 arc-45 21.47,37.34 21.47,34.09 arc45 21.65,33.65 arc45 22.25,33.41 U$1.C 25.98,33.41 arc45 27.21,33.91 27.11,33.81 arc-45 28,34.18 29.39,34.18 R5.1 | U2.37 32.97,33.39 | R5.1 29.45,34.12 | R5.1 30.41,34.14 arc-45 31.26,33.79 31.27,33.78 arc45 32.17,33.41 U2.37
MC_SPI_MISO
  Top 0.305: U2.42 32.52,29.41 arc-45 31.33,29.9 29.5,31.73 R3.1 29.29,31.73 28.73,32.29 arc45 27.55,32.78 22.17,32.78 arc-45 21.3,33.14 21.24,33.2 arc-45 20.87,34.1 20.87,36.63 arc45 20.48,37.56 arc45 19.23,38.08 U$6.DOUT 17.59,38.08 arc90 16.59,37.08 16.59,25.52 arc-90 15.59,24.52 U$1.DQ1
MC_SPI_MOSI
  Top 0.305: U$6.DIN 19.19,36.81 arc-45 19.69,36.6 arc-45 20.21,35.35 20.21,34.2 arc45 20.76,32.88 20.92,32.72 arc45 22.33,32.13 U$1.DQ0 24.23,32.13 arc-45 24.94,31.84 arc-45 25.11,31.43 25.11,31.08 arc45 25.38,30.43 26.5,29.31 R4.1 26.75,29.31 26.91,29.15 arc45 28.11,28.65 32.95,28.65 U2.43
MC_TRCLK  (via drill 0.45)
  Top 0.305: U2.21 47.81,35.01 arc45 v47.84,35.02
  Bottom 0.305: v47.84,35.02 51.4,35.02 arc45 53.24,35.78 56.64,39.18 arc45 57.37,40.95 57.37,76.55 arc45 56.64,78.32 49.72,85.24 arc45 48.3,85.83 U$22.2
MC_TRDAT  (via drill 0.45)
  Top 0.305: U2.22 46.43,35.81 v46.45,35.79
  Bottom 0.305: v46.45,35.79 51.38,35.79 arc45 53.15,36.52 55.93,39.3 arc45 56.66,41.07 56.66,76.14 arc45 55.93,77.91 49.45,84.39 arc45 48.03,84.98 45.98,84.98 arc-45 45.2,85.3 44.8,85.7 U$22.4
MCLR_MAG
  Bottom 0.305: U$22.19 37.6,90.06 arc-45 39.02,90.65 47.65,90.65 arc-45 49.07,90.06 59.25,79.88 arc-45 59.98,78.11 59.98,62.76 arc45 60.71,61 PANEL.5
MCLR_MC  (via drill 0.45)
  Top 0.305: 44.65,32.55 U2.18 v46.44,32.61 | 45.7,37.99 R1.1 46.86,37.99 arc-90 48.61,36.24 48.61,33.44 arc-90 47.79,32.62 v46.45,32.62 arc90 v46.44,32.61 | v46.44,32.61 v46.44,32.62
  Bottom 0.305: 39.83,7.9 U$17.19 39.71,6.13 arc90 40.28,5.56 49.65,5.56 arc90 51.34,7.25 51.34,28.07 arc45 50.25,30.7 48.92,32.03 arc45 47.5,32.62 v46.44,32.62 37.34,32.62 arc-45 35.92,33.21 32.02,37.11 arc45 31.12,37.48 10.88,37.48 arc-45 9.96,37.86 arc-45 9.37,39.29 9.37,42.75 arc45 9,43.65 7.65,45 PROGRAM.1
N$2
  Top 0.406: R23.2 47.77,1.65 U$21.C
N$3
  Top 0.305: U2.31 36.39,39.05 arc45 34.93,42.58 CLK1.2 arc45 35.11,44.97 C3.1
N$4
  Top 0.406: U$23.C 53.07,1.78 R24.2
N$5
  Top 0.305: U2.30 37.19,39.09 arc-45 38.65,42.62 CLK1.1 arc-45 38.46,44.9 C4.1
N$6
  Top 0.406: R25.2 58.05,1.65 U$24.C
N$7
  Top 0.406: U$25.C 63.35,1.78 R26.2
N$8  (via drill 0.45)
  Top 0.305: 37.99,24.95 38,24.95 | 37.99,24.95 U2.5 | 37.99,24.95 37.99,24.43 arc-90 36.14,22.58 33.79,22.58 arc-45 32.02,23.31 v31.77,23.56 | 26.29,25.46 R2.1 26.1,25.25 25.82,24.97 v24.92,24.97 v24.91,24.96 | U$1.S# 15.79,25.79 v15.8,25.8
  Bottom 0.305: v31.77,23.56 31.75,23.54 27.49,23.54 arc-45 25.56,24.34 24.94,24.96 v24.91,24.96 24.91,25.01 24.89,25.03 arc45 23.2,25.73 15.87,25.73 v15.8,25.8
N$9
  Top 0.305: 44.8,3.03 R23.1 46.17,4.4 arc-45 47.57,4.98 51.29,4.98 arc-45 52.14,4.63 53.2,3.57 R24.1 R25.1 55.6,5.52 arc-45 JP1.1 60.98,6.94 arc-90 63.48,4.44 R26.1
N$10
  Top 0.305: R7.1 43.83,79.46 43.83,80.04 arc45 42.86,82.38 arc45 39.36,83.83 34.59,83.83 arc45 33.65,83.44 33.47,83.26 arc-45 32.29,82.77 31.96,82.77 U$4.A
N$11
  Top 0.305: U$3.C2 34.32,81.58 31.98,81.58 U$4.C
N$12
  Top 0.305: U$2.3:1PPS 26.11,80.27 26.11,81.51 arc-45 26.3,81.96 26.39,82.05 arc-45 26.75,82.2 34.35,82.2 U$3.B1
N$13
  Top 0.305: U$3.C1 U$3.B2 40.21,82.19 arc-90 42.31,80.09 42.31,79.56 R6.1
N$15
  Top 0.305: U$18.C 31.33,38.68 R21.2
N$17  (via drill 0.5)
  Top 0.305: v39.91,12.05 38.69,13.27 10.1 | v48.21,13.3 48.19,13.32 48.19,13.58 47.69,14.08 arc-45 47.11,15.48 U$9.C 47.1,16.21 arc45 46.58,17.47 46.55,17.5 arc45 45.62,17.89 U$8.ON
  Bottom 0.305: v48.21,13.3 47.52,12.61 arc-45 46.17,12.05 v39.91,12.05
N$18
  Top 0.813: U$5.SIG U$2.11:RF_IN
N$19
  Top 0.305: U$7.S2 43.41,7.14 43.76,6.79 arc45 44.36,6.54 44.98,6.54 arc45 45.5,6.76 45.95,7.21 U$7.S1
N$20
  Top 0.305: U$8.SENSE 44,15.5 44,14.56 arc45 44.19,14.11 44.67,13.62 U$7.D2$1 U$7.D2$2 41.42,12.97 R9.1
N$22  (via drill 0.45, 0.5)
  Top 0.305: v39.19,19.93 37.91,19.93 37.83,19.85 Q1.1 | U$8.GATE 44.65,15.5 44.65,14.75 45.09,14.31 v45.13,14.31 | v48.71,11.16 48.71,9.55 arc-68 48.09,8.62 47.22,8.26 arc-45 U$7.G1 47.22,8.19 46.75,8.65 arc45 46.15,8.9 45.61,8.9 arc45 45.16,8.71 44.67,8.22 U$7.G2
  Bottom 0.305: v39.19,19.93 39.48,19.93 45.1,14.31 v45.13,14.31 45.13,14.23 48.14,14.23 arc-45 48.63,14.03 arc-45 49.22,12.6 49.22,12.2 arc-45 48.85,11.3 v48.71,11.16
N$24  (via drill 0.45)
  Top 0.305: 11.2 35.89,13.44 arc-45 35.36,13.66 34.62,13.66 v34.58,13.7
  Top 0.45: v34.64,17.33 arc-23 v34.65,17.34 Q1.3
  Top 0.813: Q1.3 Q2.1
  Bottom 0.305: v34.64,17.33 34.58,17.27 v34.58,13.7
N$25  (via drill 0.45)
  Top 0.45: U$11.ON 36.37,69.48 arc-45 36.14,69.58 35.49,70.23 arc-45 35.4,70.45 U$12.C v35.4,72.06 | v39.94,71.35 40.96,72.37 R13.1
  Bottom 0.45: v35.4,72.06 38.7,72.06 arc-45 39.6,71.69 v39.94,71.35
N$26
  Top 0.813: Q2.3 40.82,19.98 43.17,19.98 R12.2
N$28
  Top 0.45: U$10.S1 36.45,80.15 arc-45 36.75,80.86 arc-45 37.14,81.02 38.19,81.02 arc-45 38.7,80.81 arc-45 38.99,80.11 U$10.S2
N$29  (via drill 0.45)
  Top 0.45: U$10.D2$2 U$10.D2$1 37.73,75.66 v38.2,76.13 | U$10.D2$2 38.99,73.37 | 38.99,73.37 arc-90 38.74,73.12 arc90 38.42,72.8 U$11.SENSE | U$10.D2$2 38.99,73.37 | R14.1 43.85,71.63 v44.4,71.08
  Bottom 0.45: v44.4,71.08 40.08,75.4 arc45 38.31,76.13 v38.2,76.13
N$30  (via drill 0.45)
  Top 0.45: U$11.GATE 37.77,72.81 arc-45 37.73,72.83 v37.42,73.14 | v43.52,67.56 44.88,67.56 Q3.1 | U$10.G2 37.72,79.13 arc-45 37.43,78.43 37.28,78.28 v37.22,78.28 37.15,78.35 35.89,78.35 arc-45 35.48,78.52 arc-45 35.19,79.23 U$10.G1
  Bottom 0.45: v43.52,67.56 43.52,67.98 arc45 42.79,69.75 39.75,72.79 arc45 38.9,73.14 v37.42,73.14 37.22,73.34 v37.22,78.28
N$33
  Top 0.45: Q4.1 Q3.3 | 45.87,70.15 Q3.3 | Q3.3 46.37,70.65 R15.2
N$34
  Top 0.45: R16.2 42.11,67.34 Q4.3
N$35  (via drill 0.45)
  Top 0.45: U$14.ON 14.36,7.24 arc-90 13.72,7.88 13.72,8.76 arc90 13.09,9.39 U$15.C 12.72,9.42 12.72,10.54 arc-90 v12.74,10.56 | R18.1 22.11,8.78 v22.11,7.63 v22.1,7.62
  Bottom 0.45: v22.1,7.62 22.06,7.58 16.62,7.58 arc-45 15.2,8.17 12.81,10.56 v12.74,10.56
N$36
  Top 0.305: U$13.S1 14.48,17.91 14.95,18.37 arc-45 15.21,18.48 16.14,18.48 arc-45 16.67,18.26 17.02,17.91 U$13.S2
N$37  (via drill 0.45)
  Top 0.45: U$14.SENSE 16.43,10.39 arc-45 16.62,10.84 16.84,11.06 arc45 17.02,11.51 U$13.D2$2 U$13.D2$1 15.77,12.03 15.77,13.44 v15.98,13.65 | R17.1 18.44,8.41 v17.84,8.41
  Bottom 0.45: v17.84,8.41 17.84,8.46 16.57,9.73 arc-45 15.98,11.15 v15.98,13.65
N$38  (via drill 0.45)
  Top 0.305: 13.21,17.7 U$13.G1 13.21,16.48 13.73,15.97 arc45 14.18,15.78 v15.14,15.78 | 15.76,17.75 U$13.G2 15.76,16.44 arc-45 15.57,15.99 15.36,15.78 v15.14,15.78 | U$14.GATE 15.79,10.35 arc90 15.46,10.68 arc-90 15.14,11 v15.14,15.78
  Top 0.45: Q5.1 23.49,5.76 arc45 v23.63,6.1
  Bottom 0.45: v23.63,6.1 23.63,10.46 arc45 22.9,12.23 20.08,15.05 arc45 18.31,15.78 v15.14,15.78
N$41
  Top 0.45: R19.2 23.61,8.58 Q5.3 23.18,6.9 arc-45 22.91,6.79 21.36,6.79 arc-45 21.09,6.9 Q6.1
N$42
  Top 0.508: R20.2 19.71,5.13 Q6.3
OUT0_ADC  (via drill 0.45)
  Top 0.406: U$6.CH0 13.21,43.16 arc90 12.21,42.16 12.21,36.55 12.13,36.55 12.13,35.4 arc90 13.13,34.4 14.73,34.4 arc-90 15.73,33.4 15.73,27.07 v15.76,27.04
  Bottom 0.406: U$26.1 7.17,24 9.48,26.31 arc-45 11.25,27.04 v15.76,27.04
PGC_MAG
  Bottom 0.305: U$22.13 39.24,87.89 arc-45 40.66,88.48 46.74,88.48 arc-45 48.16,87.89 57.3,78.75 arc-45 58.03,76.98 58.03,55.63 arc45 59.49,52.1 60.59,51 PANEL.1
PGC_MC  (via drill 0.45)
  Top 0.305: U2.16 44.62,30.98 v46.42,30.98 v46.43,30.97 | v41.51,7.03 41.51,6.99 41.39,6.87 41.39,6.65 arc-90 40.12,5.38 36.15,5.38 arc-45 35.25,5.75 35.01,5.99 arc-45 34.64,6.89 U$17.11
  Bottom 0.305: PROGRAM.5 8,35 arc45 8.9,35.37 9.3,35.77 arc-45 10.2,36.14 30.9,36.14 arc-45 31.8,35.77 36.01,31.56 arc45 37.43,30.97 v46.43,30.97 arc-45 47.69,30.45 48.85,29.29 arc-45 49.96,26.61 49.96,8.21 arc-90 48.69,6.94 41.6,6.94 v41.51,7.03
PGD_MAG
  Bottom 0.305: U$22.15 38.67,88.59 arc-45 40.09,89.18 47.08,89.18 arc-45 48.5,88.59 57.97,79.12 arc-45 58.7,77.35 58.7,57.26 arc45 60.16,53.73 60.39,53.5 PANEL.2
PGD_MC  (via drill 0.45)
  Top 0.305: v47.46,31.77 44.63,31.77 U2.17 | v40.5,6.38 36.95,6.38 arc-45 36.28,6.66 arc-45 35.91,7.56 U$17.13
  Bottom 0.305: PROGRAM.4 8.25,37.5 arc-45 9.15,37.13 arc45 9.94,36.8 31.05,36.8 arc-45 31.95,36.43 36.02,32.36 arc45 37.44,31.77 v47.46,31.77 arc-45 48.16,31.48 49.47,30.17 arc-45 50.64,27.35 50.64,7.72 arc-90 49.18,6.26 40.54,6.26 40.5,6.3 v40.5,6.38
RESET_MAG
  Bottom 0.305: U$17.15 37.18,6.28 arc90 39.21,4.25 62.41,4.25 arc90 64.91,6.75 64.91,18.57 arc45 63.7,21.5 63.69,21.51 arc45 61.9,22.25 61.55,22.25 MAG_PWR.2
RESET_MC_EL  (via drill 0.45)
  Top 0.305: v48.44,12.23 48.45,12.21 49.25,13.01 49.25,14.54 U$9.B | JP4.2 27.57,19.14 29.49,17.21 v29.51,17.21 | v34.31,10.63 34.36,10.68 36.43,10.68 arc-45 37.3,10.32 U$17.18
  Bottom 0.305: v48.44,12.23 48.14,11.93 arc-45 46.72,11.34 41.47,11.34 arc45 40.05,10.75 38.47,9.17 U$17.18 | v29.51,17.21 v29.51,17.2 33.75,12.96 arc-45 34.34,11.54 34.34,10.66 v34.31,10.63
RESET_MC_GNSS  (via drill 0.45)
  Top 0.305: U2.39 30.89,31.81 v30.87,31.83 | v34.14,71.03 33.3,71.87 U$12.B
  Bottom 0.305: v30.87,31.83 30.7,31.66 arc-45 28.97,30.94 arc-45 25.44,32.4 25.25,32.59 arc45 23.83,33.18 7.13,33.18 arc-45 5.09,34.02 arc-45 4.51,35.44 4.51,54.55 arc-90 5.78,55.82 17.98,55.82 arc45 23.82,58.24 33.44,67.86 arc45 34.14,69.54 v34.14,71.03
RESET_RPI  (via drill 0.45)
  Top 0.305: U$17.20 37.87,11.02 arc45 36.97,11.39 v33.44,11.39
  Top 0.45: U$15.B 11.24,9.69 arc-45 11.53,8.99 arc45 11.67,8.65 12.16,8.16 12.16,8.14 v12.26,8.04
  Bottom 0.305: v33.44,11.39 27.65,11.39 | 27.65,11.39 arc45 27.63,11.38 | v12.26,8.04 12.37,8.04 14.42,5.99 arc45 16.45,5.15 24.07,5.15 arc90 26.07,7.15 26.07,9.26 arc-45 26.8,11.03 26.81,11.04 arc-45 27.65,11.39
RPI_EPS_IO_1
  Top 0.305: U$22.1 58.5,87.1 60.6,85 U$20.1
RPI_EPS_IO_2
  Top 0.305: U$22.3 45.67,87.97 60.83,87.97 U$20.2
RX_GNSS  (via drill 0.45)
  Top 0.305: v31.03,27.06 31.41,27.44 arc-45 32.31,27.81 U2.44
  Top 0.45: U$2.21:RXD 24.99,66.09 arc-45 24.8,65.64 21.28,62.12 JP2.3
  Bottom 0.305: v31.03,27.06 30.34,27.06 arc-45 29.4,27.45 24.84,32.01 arc45 23.42,32.6 6.87,32.6 arc-45 4.72,33.49 arc-45 3.78,35.76 3.78,55.86 arc-90 6.23,58.31 16.89,58.31 arc45 18.68,59.05 JP2.3
RX_MC_TX_MAG
  Top 0.305: U2.14 53.77,29.41 arc45 55.54,30.14 58.34,32.94 arc45 58.71,33.84 58.71,37.69 arc-53 59.71,39.69 61.03,40.68 MAG.4
RX_MC_TX_MAIN  (via drill 0.45)
  Top 0.305: U2.3 36.35,25.97 v36.35,23.42
  Bottom 0.305: v36.35,23.42 36.35,10.27 arc-45 35.91,9.21 U$17.14
RX_MC_TX_RPI  (via drill 0.45)
  Top 0.305: v47.46,33.41 U2.19
  Bottom 0.305: v47.46,33.41 47.46,33.71 arc45 46.99,34.84 arc45 46.55,35.02 37,35.02 arc-45 35.23,35.75 32.86,38.12 arc45 31.44,38.71 11.92,38.71 arc-90 10.92,39.71 10.92,50.04 arc45 9.67,53.06 9.21,53.52 arc45 7.11,54.39 6.81,54.39 RPI.4
TX_GNSS  (via drill 0.45)
  Top 0.305: U2.1 34.79,25.64 arc-45 34.29,24.43 v34,24.43
  Top 0.45: U$2.20:TXD 23.89,66.4 arc-45 23.7,65.95 22.16,64.41 arc-45 21.46,64.12 20.41,64.12 arc45 19.71,63.83 18.74,62.86 JP2.2
  Bottom 0.305: 33.93,24.43 v34,24.43 31.5,24.43 arc-45 30.12,25 24.31,30.81 arc45 22.89,31.4 5.63,31.4 arc-90 3.1,33.93 3.1,61.11 arc-90 6.17,64.18 16.2,64.18 arc-45 17.99,63.44 18.74,62.69 JP2.2
TX_MC_RX_MAG
  Top 0.305: U2.15 53.73,30.21 arc45 55.5,30.94 57.77,33.21 arc45 58.14,34.11 58.14,39.72 arc-52 59.09,41.69 60.95,43.14 MAG.5
TX_MC_RX_MAIN  (via drill 0.45)
  Top 0.305: v35.23,23.44 arc45 35.6,24.33 U2.2
  Bottom 0.305: 35.23,23.32 v35.23,23.44 35.31,23.36 35.31,23.17 arc-45 35.52,22.66 35.52,10.88 arc-45 34.93,9.46 U$17.12
TX_MC_RX_RPI  (via drill 0.45)
  Top 0.305: U2.20 46.39,34.21 v46.43,34.25
  Bottom 0.305: v46.43,34.25 36.85,34.25 arc-45 35.08,34.98 32.58,37.48 arc45 31.16,38.07 11.43,38.07 arc-90 10.13,39.36 10.13,49.59 arc45 9.76,50.5 9.22,51.04 arc45 6.9,52 RPI.5
VDD_MAG
  Bottom 0.305: U$22.17 38.1,89.29 arc-45 39.52,89.88 47.4,89.88 arc-45 48.82,89.29 58.6,79.51 arc-45 59.33,77.74 59.33,61.52 arc45 60.58,58.5 PANEL.4
VREF_2V5
  Top 0.45: U$6.VREF 19.84,41.89 arc-90 20.84,40.89 20.84,40.88 arc90 21.84,39.88 U$19.VOUT_FORCE U$19.VOUT_SENSE 23,39.23 arc-90 23.83,38.41 23.83,36.47 C13.1
  Top 0.508: 23.98,36.62 C13.1

### Text on the board
tNames: YOTSUBA_EM_MC_ver.2.0 | +X | PWR/COM:RPI | TX RX | TML:MAG | TML:MC | COM:MAG | ADC IN | RESET | PWR:MAG | 5V0 | MC_EL
bNames: -X